# EAGLE schematic teensyShield1.0 (EAGLE 7.5.0)
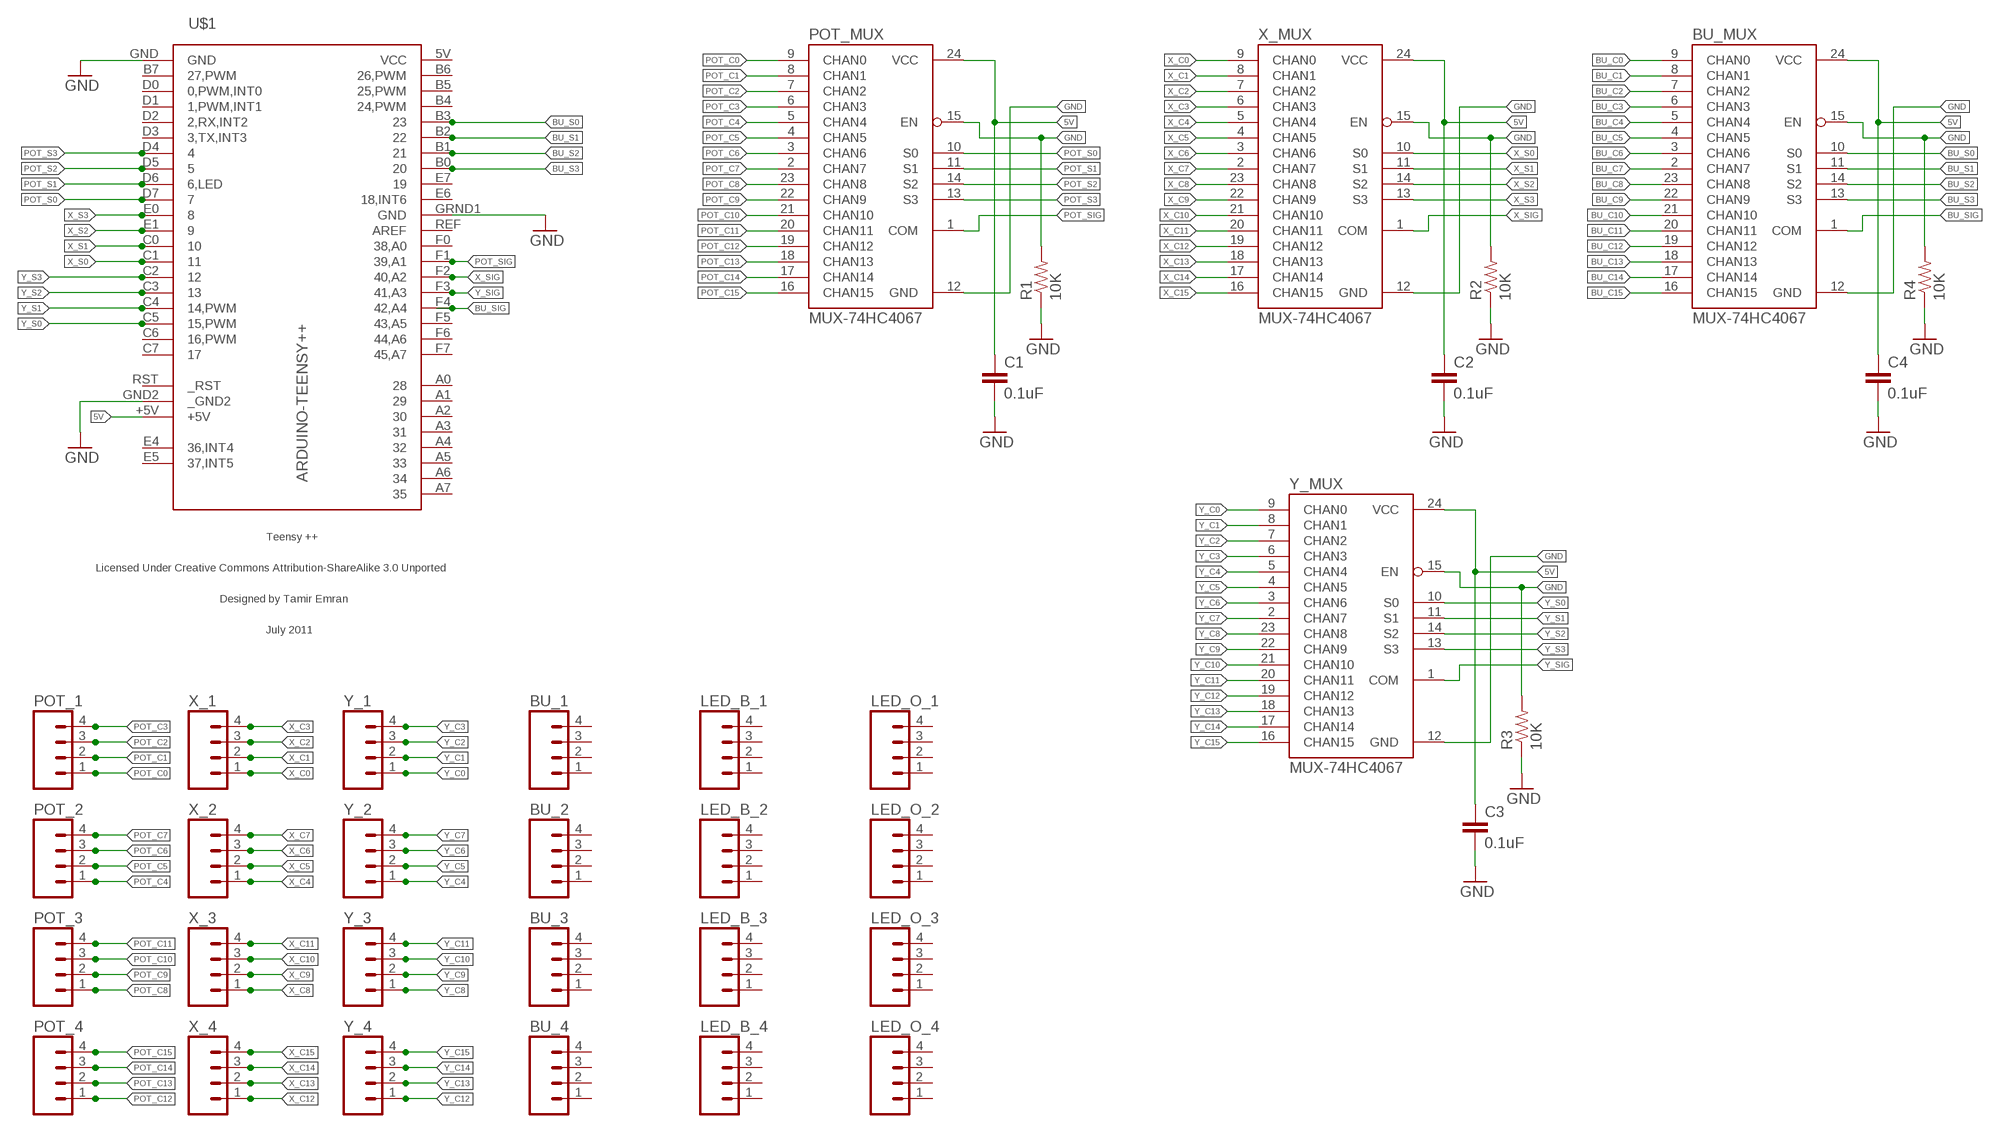
[diagram p0: schematic, sheet 1]

## Parts
BU_1  M04NO_SILK_ALL_ROUND  [1X04_NO_SILK_ALL_ROUND]
BU_2  M04NO_SILK_ALL_ROUND  [1X04_NO_SILK_ALL_ROUND]
BU_3  M04NO_SILK_ALL_ROUND  [1X04_NO_SILK_ALL_ROUND]
BU_4  M04NO_SILK_ALL_ROUND  [1X04_NO_SILK_ALL_ROUND]
BU_MUX  MUX-74HC4067  MUX-74HC4067SMD  [SSOP24]
C1  0.1uF  CAP0603  [0603]
C2  0.1uF  CAP0603  [0603]
C3  0.1uF  CAP0603  [0603]
C4  0.1uF  CAP0603  [0603]
LED_B_1  M04NO_SILK_ALL_ROUND  [1X04_NO_SILK_ALL_ROUND]
LED_B_2  M04NO_SILK_ALL_ROUND  [1X04_NO_SILK_ALL_ROUND]
LED_B_3  M04NO_SILK_ALL_ROUND  [1X04_NO_SILK_ALL_ROUND]
LED_B_4  M04NO_SILK_ALL_ROUND  [1X04_NO_SILK_ALL_ROUND]
LED_O_1  M04NO_SILK_ALL_ROUND  [1X04_NO_SILK_ALL_ROUND]
LED_O_2  M04NO_SILK_ALL_ROUND  [1X04_NO_SILK_ALL_ROUND]
LED_O_3  M04NO_SILK_ALL_ROUND  [1X04_NO_SILK_ALL_ROUND]
LED_O_4  M04NO_SILK_ALL_ROUND  [1X04_NO_SILK_ALL_ROUND]
POT_1  M04NO_SILK_ALL_ROUND  [1X04_NO_SILK_ALL_ROUND]
POT_2  M04NO_SILK_ALL_ROUND  [1X04_NO_SILK_ALL_ROUND]
POT_3  M04NO_SILK_ALL_ROUND  [1X04_NO_SILK_ALL_ROUND]
POT_4  M04NO_SILK_ALL_ROUND  [1X04_NO_SILK_ALL_ROUND]
POT_MUX  MUX-74HC4067  MUX-74HC4067SMD  [SSOP24]
R1  10K  RESISTOR0603  [0603]
R2  10K  RESISTOR0603  [0603]
R3  10K  RESISTOR0603  [0603]
R4  10K  RESISTOR0603  [0603]
U$1  ARDUINO-TEENSY++  [TEENSY++]
X_1  M04NO_SILK_ALL_ROUND  [1X04_NO_SILK_ALL_ROUND]
X_2  M04NO_SILK_ALL_ROUND  [1X04_NO_SILK_ALL_ROUND]
X_3  M04NO_SILK_ALL_ROUND  [1X04_NO_SILK_ALL_ROUND]
X_4  M04NO_SILK_ALL_ROUND  [1X04_NO_SILK_ALL_ROUND]
X_MUX  MUX-74HC4067  MUX-74HC4067SMD  [SSOP24]
Y_1  M04NO_SILK_ALL_ROUND  [1X04_NO_SILK_ALL_ROUND]
Y_2  M04NO_SILK_ALL_ROUND  [1X04_NO_SILK_ALL_ROUND]
Y_3  M04NO_SILK_ALL_ROUND  [1X04_NO_SILK_ALL_ROUND]
Y_4  M04NO_SILK_ALL_ROUND  [1X04_NO_SILK_ALL_ROUND]
Y_MUX  MUX-74HC4067  MUX-74HC4067SMD  [SSOP24]

## Nets
5V: BU_MUX.24(VCC) C1.1 C2.1 C3.1 C4.1 POT_MUX.24(VCC) X_MUX.24(VCC) Y_MUX.24(VCC)
BU_C0: BU_MUX.9(CHAN0)
BU_C1: BU_MUX.8(CHAN1)
BU_C2: BU_MUX.7(CHAN2)
BU_C3: BU_MUX.6(CHAN3)
BU_C4: BU_MUX.5(CHAN4)
BU_C5: BU_MUX.4(CHAN5)
BU_C6: BU_MUX.3(CHAN6)
BU_C7: BU_MUX.2(CHAN7)
BU_C8: BU_MUX.23(CHAN8)
BU_C9: BU_MUX.22(CHAN9)
BU_C10: BU_MUX.21(CHAN10)
BU_C11: BU_MUX.20(CHAN11)
BU_C12: BU_MUX.19(CHAN12)
BU_C13: BU_MUX.18(CHAN13)
BU_C14: BU_MUX.17(CHAN14)
BU_C15: BU_MUX.16(CHAN15)
BU_S0: BU_MUX.10(S0) U$1.B3
BU_S1: BU_MUX.11(S1) U$1.B2
BU_S2: BU_MUX.14(S2) U$1.B1
BU_S3: BU_MUX.13(S3) U$1.B0
BU_SIG: BU_MUX.1(COM) U$1.F4(42,A4)
GND: BU_MUX.12(GND) BU_MUX.15(EN) C1.2 C2.2 C3.2 C4.2 POT_MUX.12(GND) POT_MUX.15(EN) R1.1 R1.2 R2.1 R2.2 R3.1 R3.2 R4.1 R4.2 U$1.GND U$1.GND2(_GND2) U$1.GRND1(GND) X_MUX.12(GND) X_MUX.15(EN) Y_MUX.12(GND) Y_MUX.15(EN)
N$1: U$1.F2(40,A2)
N$2: U$1.F1(39,A1)
N$4: U$1.+5V
POT_C0: POT_1.1 POT_MUX.9(CHAN0)
POT_C1: POT_1.2 POT_MUX.8(CHAN1)
POT_C2: POT_1.3 POT_MUX.7(CHAN2)
POT_C3: POT_1.4 POT_MUX.6(CHAN3)
POT_C4: POT_2.1 POT_MUX.5(CHAN4)
POT_C5: POT_2.2 POT_MUX.4(CHAN5)
POT_C6: POT_2.3 POT_MUX.3(CHAN6)
POT_C7: POT_2.4 POT_MUX.2(CHAN7)
POT_C8: POT_3.1 POT_MUX.23(CHAN8)
POT_C9: POT_3.2 POT_MUX.22(CHAN9)
POT_C10: POT_3.3 POT_MUX.21(CHAN10)
POT_C11: POT_3.4 POT_MUX.20(CHAN11)
POT_C12: POT_4.1 POT_MUX.19(CHAN12)
POT_C13: POT_4.2 POT_MUX.18(CHAN13)
POT_C14: POT_4.3 POT_MUX.17(CHAN14)
POT_C15: POT_4.4 POT_MUX.16(CHAN15)
POT_S0: POT_MUX.10(S0) U$1.D7
POT_S1: POT_MUX.11(S1) U$1.D6(6,LED)
POT_S2: POT_MUX.14(S2) U$1.D5
POT_S3: POT_MUX.13(S3) U$1.D4
POT_SIG: POT_MUX.1(COM)
X_C0: X_1.1 X_MUX.9(CHAN0)
X_C1: X_1.2 X_MUX.8(CHAN1)
X_C2: X_1.3 X_MUX.7(CHAN2)
X_C3: X_1.4 X_MUX.6(CHAN3)
X_C4: X_2.1 X_MUX.5(CHAN4)
X_C5: X_2.2 X_MUX.4(CHAN5)
X_C6: X_2.3 X_MUX.3(CHAN6)
X_C7: X_2.4 X_MUX.2(CHAN7)
X_C8: X_3.1 X_MUX.23(CHAN8)
X_C9: X_3.2 X_MUX.22(CHAN9)
X_C10: X_3.3 X_MUX.21(CHAN10)
X_C11: X_3.4 X_MUX.20(CHAN11)
X_C12: X_4.1 X_MUX.19(CHAN12)
X_C13: X_4.2 X_MUX.18(CHAN13)
X_C14: X_4.3 X_MUX.17(CHAN14)
X_C15: X_4.4 X_MUX.16(CHAN15)
X_S0: U$1.C1 X_MUX.10(S0)
X_S1: U$1.C0 X_MUX.11(S1)
X_S2: U$1.E1 X_MUX.14(S2)
X_S3: U$1.E0 X_MUX.13(S3)
X_SIG: X_MUX.1(COM)
Y_C0: Y_1.1 Y_MUX.9(CHAN0)
Y_C1: Y_1.2 Y_MUX.8(CHAN1)
Y_C2: Y_1.3 Y_MUX.7(CHAN2)
Y_C3: Y_1.4 Y_MUX.6(CHAN3)
Y_C4: Y_2.1 Y_MUX.5(CHAN4)
Y_C5: Y_2.2 Y_MUX.4(CHAN5)
Y_C6: Y_2.3 Y_MUX.3(CHAN6)
Y_C7: Y_2.4 Y_MUX.2(CHAN7)
Y_C8: Y_3.1 Y_MUX.23(CHAN8)
Y_C9: Y_3.2 Y_MUX.22(CHAN9)
Y_C10: Y_3.3 Y_MUX.21(CHAN10)
Y_C11: Y_3.4 Y_MUX.20(CHAN11)
Y_C12: Y_4.1 Y_MUX.19(CHAN12)
Y_C13: Y_4.2 Y_MUX.18(CHAN13)
Y_C14: Y_4.3 Y_MUX.17(CHAN14)
Y_C15: Y_4.4 Y_MUX.16(CHAN15)
Y_S0: U$1.C5(15,PWM) Y_MUX.10(S0)
Y_S1: U$1.C4(14,PWM) Y_MUX.11(S1)
Y_S2: U$1.C3 Y_MUX.14(S2)
Y_S3: U$1.C2 Y_MUX.13(S3)
Y_SIG: U$1.F3(41,A3) Y_MUX.1(COM)
Unconnected: BU_1.1 BU_1.2 BU_1.3 BU_1.4 BU_2.1 BU_2.2 BU_2.3 BU_2.4 BU_3.1 BU_3.2 BU_3.3 BU_3.4 BU_4.1 BU_4.2 BU_4.3 BU_4.4 LED_B_1.1 LED_B_1.2 LED_B_1.3 LED_B_1.4 LED_B_2.1 LED_B_2.2 LED_B_2.3 LED_B_2.4 LED_B_3.1 LED_B_3.2 LED_B_3.3 LED_B_3.4 LED_B_4.1 LED_B_4.2 LED_B_4.3 LED_B_4.4 LED_O_1.1 LED_O_1.2 LED_O_1.3 LED_O_1.4 LED_O_2.1 LED_O_2.2 LED_O_2.3 LED_O_2.4 LED_O_3.1 LED_O_3.2 LED_O_3.3 LED_O_3.4 LED_O_4.1 LED_O_4.2 LED_O_4.3 LED_O_4.4 U$1.A0 U$1.A1 U$1.A2 U$1.A3 U$1.A4 U$1.A5 U$1.A6 U$1.A7 U$1.B4(24,PWM) U$1.B5(25,PWM) U$1.B6(26,PWM) U$1.B7(27,PWM) U$1.C6(16,PWM) U$1.C7 U$1.D0(0,PWM,INT0) U$1.D1(1,PWM,INT1) U$1.D2(2,RX,INT2) U$1.D3(3,TX,INT3) U$1.E4(36,INT4) U$1.E5(37,INT5) U$1.E6(18,INT6) U$1.E7 U$1.F0(38,A0) U$1.F5(43,A5) U$1.F6(44,A6) U$1.F7(45,A7) U$1.REF(AREF) U$1.RST(_RST)

## Power pins joined to a net without a drawn wire
VCC: U$1.5V(VCC)

## Library data of the parts
BU_1-BU_4 LED_B_1-LED_B_4 LED_O_1-LED_O_4 POT_1-POT_4 X_1-X_4 Y_1-Y_4 = SparkFun-Connectors:M04: Header 4 Standard 4-pin 0.1" header. Use with straight break away headers (SKU : PRT-00116), right angle break away headers (PRT-00553), swiss pins (PRT-00743), machine pins (PRT-00117), and female headers (PRT-00115). Molex polarized connector foot print use with SKU : PRT-08231 with associated crimp pins and housings. 1MM SMD Version SKU: PRT-10208; PROD_ID: CONN-09696
BU_MUX POT_MUX X_MUX Y_MUX = SparkFun:MUX-74HC4067
C1-C4 = SparkFun:CAP: Capacitor Standard 0603 ceramic capacitor, and 0.1" leaded capacitor.
R1-R4 = SparkFun:RESISTOR: Resistor Basic schematic elements and footprints for 0603, 1206, and PTH 1/10th watt (small) resistors.
U$1 = teensypp:ARDUINO-TEENSY++: Teensy ++ Original Design by Mark Gross Modified Design by Tamir Emran Licensed Under Creative Commons Attribution-ShareAlike 3.0 Unported (CC BY-SA 3.0)